# Altium schematic sheet Sheet7.SchDoc
size A3
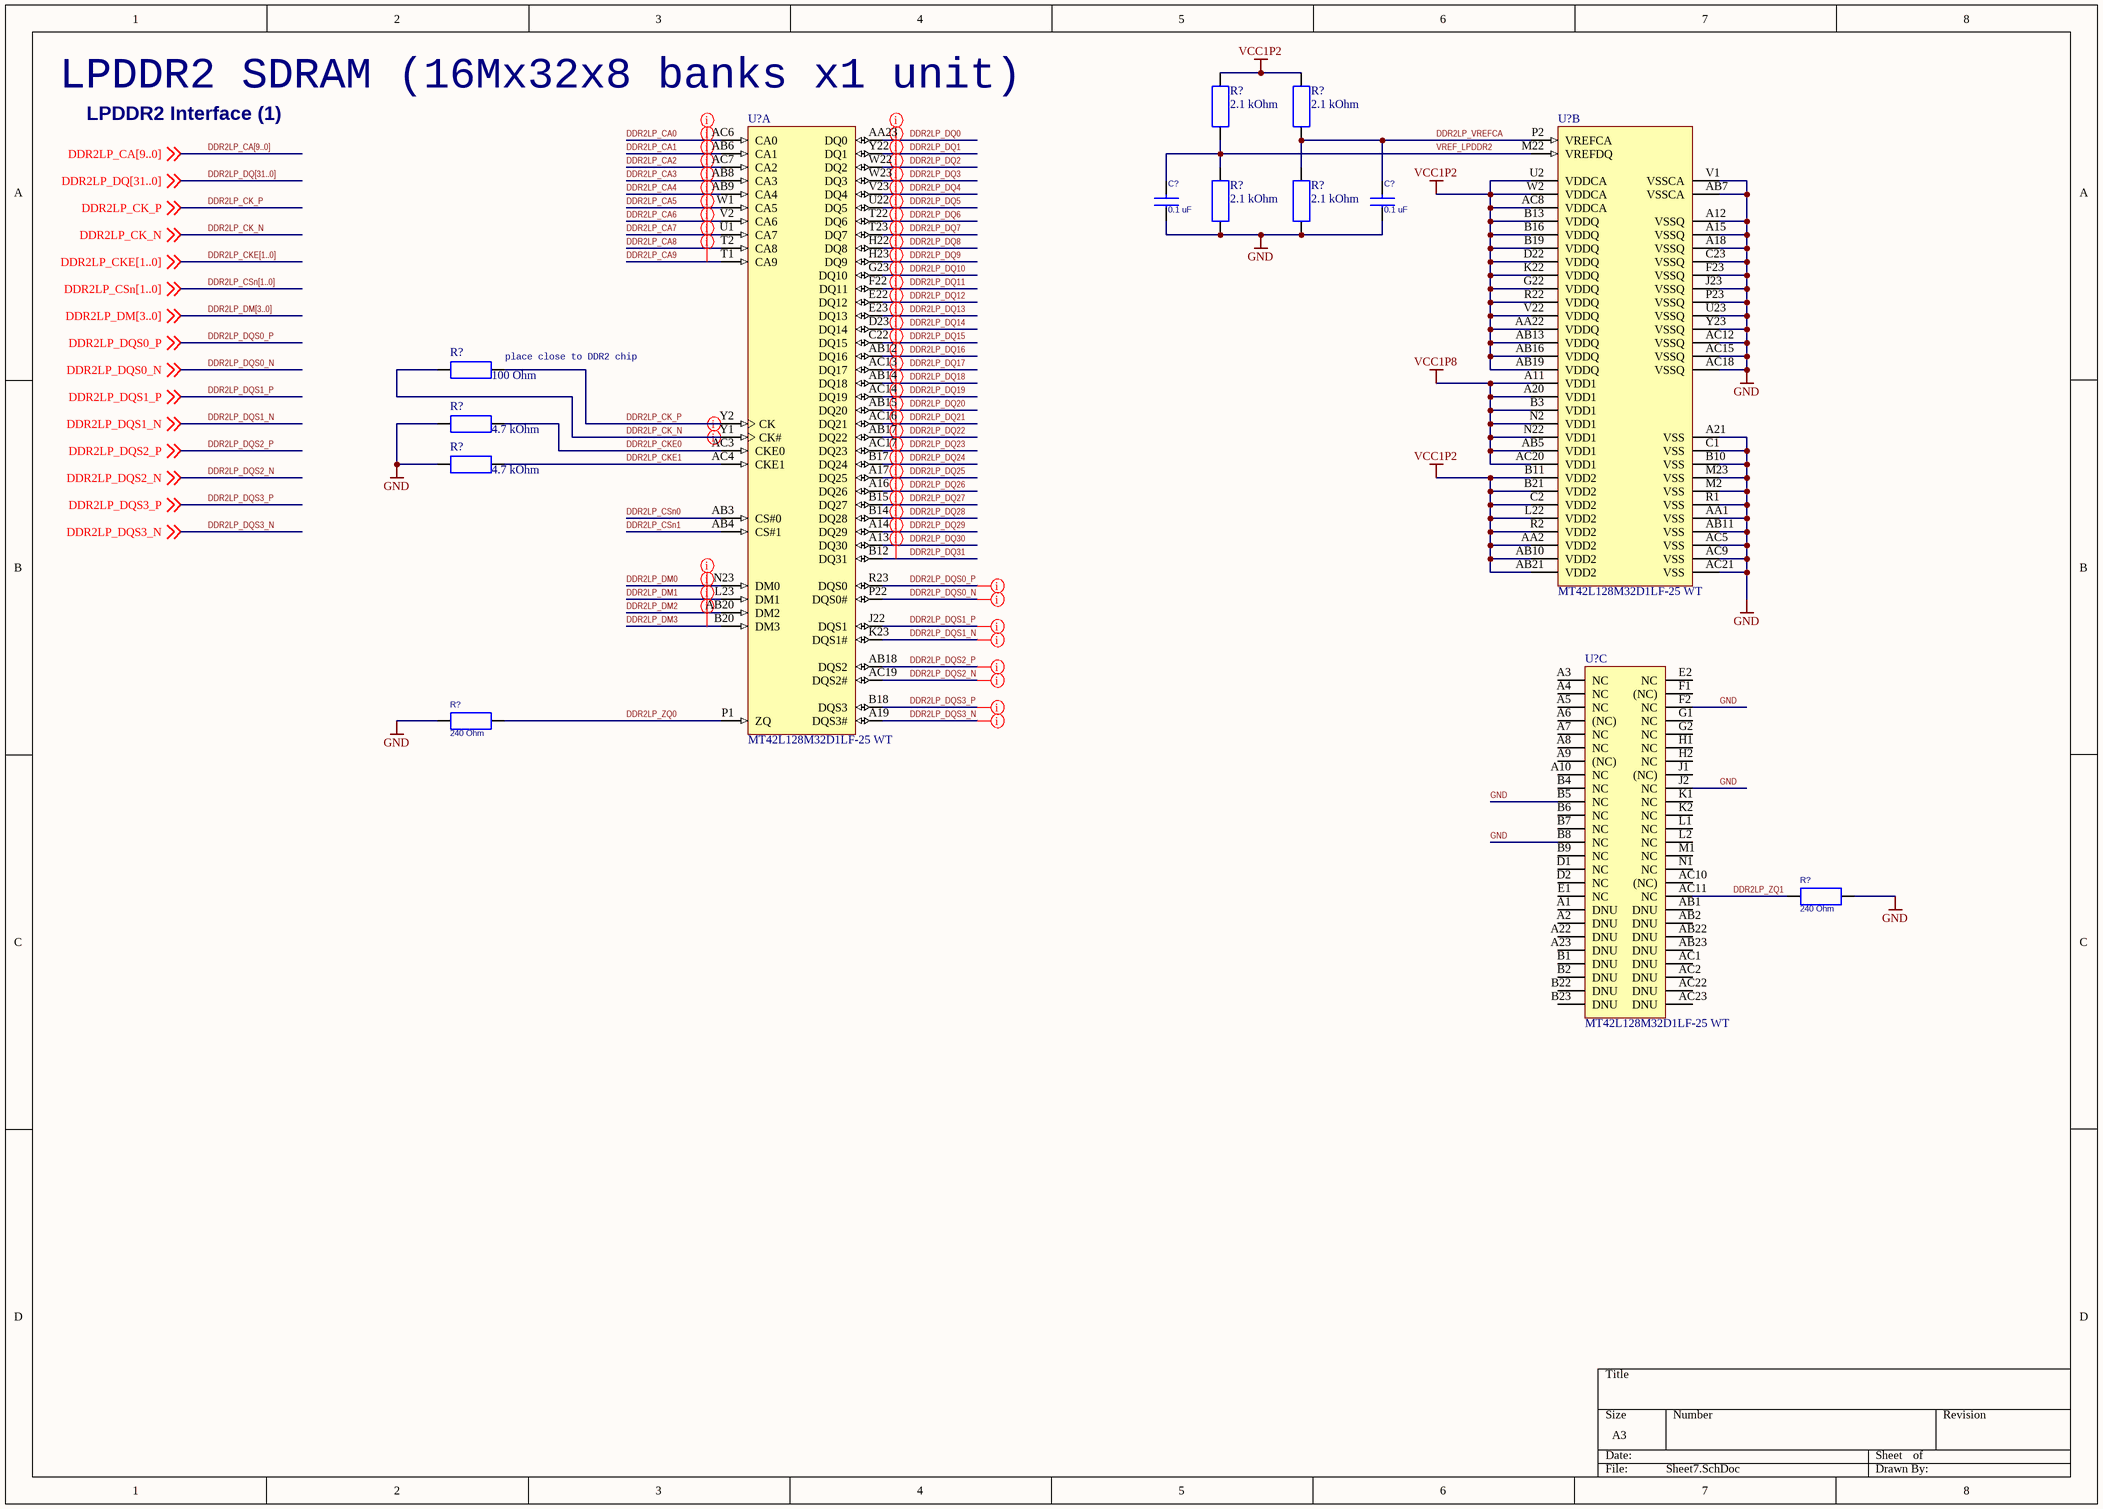
[diagram p0: Sheet7.SchDoc]

## Parts
(Parts that share a designator on the sheet are numbered #1, #2 ... from top to bottom, then left to right.)
C?#1  0.1 uF  [CAPC1608N]
C?#2  0.1 uF  [CAPC1608N]
R?#1  2.1 kOhm  [RESC1608N]
R?#2  2.1 kOhm  [RESC1608N]
R?#3  2.1 kOhm  [RESC1608N]
R?#4  2.1 kOhm  [RESC1608N]
R?#5  100 Ohm  [RESC1608N]
R?#6  4.7 kOhm  [RESC1608N]
R?#7  4.7 kOhm  [RESC1608N]
R?#8  240 Ohm  [RESC1608N]
R?#9  240 Ohm  [RESC1608N]
U?#1  MT42L128M32D1LF-25 WT  [MICT-LF-168]  (part A of 3)
U?#2  MT42L128M32D1LF-25 WT  [MICT-LF-168]  (part B of 3)
U?#3  MT42L128M32D1LF-25 WT  [MICT-LF-168]  (part C of 3)

## Nets
GND: C?#1.1 C?#2.1 R?#3.1 R?#4.1 R?#6.2 R?#7.2 R?#8.1 R?#9.2 U?#2.A12(VSSQ) U?#2.A15(VSSQ) U?#2.A18(VSSQ) U?#2.A21(VSS) U?#2.AA1(VSS) U?#2.AB7(VSSCA) U?#2.AB11(VSS) U?#2.AC5(VSS) U?#2.AC9(VSS) U?#2.AC12(VSSQ) U?#2.AC15(VSSQ) U?#2.AC18(VSSQ) U?#2.AC21(VSS) U?#2.B10(VSS) U?#2.C1(VSS) U?#2.C23(VSSQ) U?#2.F23(VSSQ) U?#2.J23(VSSQ) U?#2.M2(VSS) U?#2.M23(VSS) U?#2.P23(VSSQ) U?#2.R1(VSS) U?#2.U23(VSSQ) U?#2.V1(VSSCA) U?#2.Y23(VSSQ) U?#3.B5(NC) U?#3.B8(NC) U?#3.F2(NC) U?#3.J2(NC)
VCC1P2: R?#1.2 R?#2.2 U?#2.AA2(VDD2) U?#2.AA22(VDDQ) U?#2.AB10(VDD2) U?#2.AB13(VDDQ) U?#2.AB16(VDDQ) U?#2.AB19(VDDQ) U?#2.AB21(VDD2) U?#2.AC8(VDDCA) U?#2.B11(VDD2) U?#2.B13(VDDQ) U?#2.B16(VDDQ) U?#2.B19(VDDQ) U?#2.B21(VDD2) U?#2.C2(VDD2) U?#2.D22(VDDQ) U?#2.G22(VDDQ) U?#2.K22(VDDQ) U?#2.L22(VDD2) U?#2.R2(VDD2) U?#2.R22(VDDQ) U?#2.U2(VDDCA) U?#2.V22(VDDQ) U?#2.W2(VDDCA)
VCC1P8: U?#2.A11(VDD1) U?#2.A20(VDD1) U?#2.AB5(VDD1) U?#2.AC20(VDD1) U?#2.B3(VDD1) U?#2.N2(VDD1) U?#2.N22(VDD1)
DDR2LP_CA0: U?#1.AC6(CA0)
DDR2LP_CA1: U?#1.AB6(CA1)
DDR2LP_CA2: U?#1.AC7(CA2)
DDR2LP_CA3: U?#1.AB8(CA3)
DDR2LP_CA4: U?#1.AB9(CA4)
DDR2LP_CA5: U?#1.W1(CA5)
DDR2LP_CA6: U?#1.V2(CA6)
DDR2LP_CA7: U?#1.U1(CA7)
DDR2LP_CA8: U?#1.T2(CA8)
DDR2LP_CA9: U?#1.T1(CA9)
DDR2LP_CK_N: R?#5.2 U?#1.Y1(CK#) ; off-sheet DDR2LP_CK_N
DDR2LP_CK_P: R?#5.1 U?#1.Y2(CK) ; off-sheet DDR2LP_CK_P
DDR2LP_CKE0: R?#6.1 U?#1.AC3(CKE0)
DDR2LP_CKE1: R?#7.1 U?#1.AC4(CKE1)
DDR2LP_CSn0: U?#1.AB3(CS#0)
DDR2LP_CSn1: U?#1.AB4(CS#1)
DDR2LP_DM0: U?#1.N23(DM0)
DDR2LP_DM1: U?#1.L23(DM1)
DDR2LP_DM2: U?#1.AB20(DM2)
DDR2LP_DM3: U?#1.B20(DM3)
DDR2LP_DQ0: U?#1.AA23(DQ0)
DDR2LP_DQ1: U?#1.Y22(DQ1)
DDR2LP_DQ2: U?#1.W22(DQ2)
DDR2LP_DQ3: U?#1.W23(DQ3)
DDR2LP_DQ4: U?#1.V23(DQ4)
DDR2LP_DQ5: U?#1.U22(DQ5)
DDR2LP_DQ6: U?#1.T22(DQ6)
DDR2LP_DQ7: U?#1.T23(DQ7)
DDR2LP_DQ8: U?#1.H22(DQ8)
DDR2LP_DQ9: U?#1.H23(DQ9)
DDR2LP_DQ10: U?#1.G23(DQ10)
DDR2LP_DQ11: U?#1.F22(DQ11)
DDR2LP_DQ12: U?#1.E22(DQ12)
DDR2LP_DQ13: U?#1.E23(DQ13)
DDR2LP_DQ14: U?#1.D23(DQ14)
DDR2LP_DQ15: U?#1.C22(DQ15)
DDR2LP_DQ16: U?#1.AB12(DQ16)
DDR2LP_DQ17: U?#1.AC13(DQ17)
DDR2LP_DQ18: U?#1.AB14(DQ18)
DDR2LP_DQ19: U?#1.AC14(DQ19)
DDR2LP_DQ20: U?#1.AB15(DQ20)
DDR2LP_DQ21: U?#1.AC16(DQ21)
DDR2LP_DQ22: U?#1.AB17(DQ22)
DDR2LP_DQ23: U?#1.AC17(DQ23)
DDR2LP_DQ24: U?#1.B17(DQ24)
DDR2LP_DQ25: U?#1.A17(DQ25)
DDR2LP_DQ26: U?#1.A16(DQ26)
DDR2LP_DQ27: U?#1.B15(DQ27)
DDR2LP_DQ28: U?#1.B14(DQ28)
DDR2LP_DQ29: U?#1.A14(DQ29)
DDR2LP_DQ30: U?#1.A13(DQ30)
DDR2LP_DQ31: U?#1.B12(DQ31)
DDR2LP_DQS0_N: U?#1.P22(DQS0#) ; off-sheet DDR2LP_DQS0_N
DDR2LP_DQS0_P: U?#1.R23(DQS0) ; off-sheet DDR2LP_DQS0_P
DDR2LP_DQS1_N: U?#1.K23(DQS1#) ; off-sheet DDR2LP_DQS1_N
DDR2LP_DQS1_P: U?#1.J22(DQS1) ; off-sheet DDR2LP_DQS1_P
DDR2LP_DQS2_N: U?#1.AC19(DQS2#) ; off-sheet DDR2LP_DQS2_N
DDR2LP_DQS2_P: U?#1.AB18(DQS2) ; off-sheet DDR2LP_DQS2_P
DDR2LP_DQS3_N: U?#1.A19(DQS3#) ; off-sheet DDR2LP_DQS3_N
DDR2LP_DQS3_P: U?#1.B18(DQS3) ; off-sheet DDR2LP_DQS3_P
DDR2LP_VREFCA: C?#2.2 R?#2.1 R?#4.2 U?#2.P2(VREFCA)
DDR2LP_ZQ0: R?#8.2 U?#1.P1(ZQ)
DDR2LP_ZQ1: R?#9.1 U?#3.AC11(NC)
VREF_LPDDR2: C?#1.2 R?#1.1 R?#3.2 U?#2.M22(VREFDQ)

Not connected (* = marked no-connect by the designer): U?#3 A1(DNU) A2(DNU) A3(NC) A4(NC) A5(NC) A6((NC)) A7(NC) A8(NC) A9((NC)) A10(NC) A22(DNU) A23(DNU) AB1(DNU) AB2(DNU) AB22(DNU) AB23(DNU) AC1(DNU) AC2(DNU) AC10((NC)) AC22(DNU) AC23(DNU) B1(DNU) B2(DNU) B4(NC) B6(NC) B7(NC) B9(NC) B22(DNU) B23(DNU) D1(NC) D2(NC) E1(NC) E2(NC) F1((NC)) G1(NC) G2(NC) H1(NC) H2(NC) J1((NC)) K1(NC) K2(NC) L1(NC) L2(NC) M1(NC) N1(NC)

## Buses and harness runs
bus DDR2LP_CA[9..0]
bus DDR2LP_CKE[1..0]
bus DDR2LP_CSn[1..0]
bus DDR2LP_DM[3..0]
bus DDR2LP_DQ[31..0]

## Layout directives
net class DDR2LP_DQ: DDR2LP_DQ0, DDR2LP_DQ1, DDR2LP_DQ2, DDR2LP_DQ3, DDR2LP_DQ4, DDR2LP_DQ5, DDR2LP_DQ6, DDR2LP_DQ7, DDR2LP_DQ8, DDR2LP_DQ9, DDR2LP_DQ10, DDR2LP_DQ11, DDR2LP_DQ12, DDR2LP_DQ13, DDR2LP_DQ14, DDR2LP_DQ15, DDR2LP_DQ16, DDR2LP_DQ17, DDR2LP_DQ18, DDR2LP_DQ19, DDR2LP_DQ20, DDR2LP_DQ21, DDR2LP_DQ22, DDR2LP_DQ23, DDR2LP_DQ24, DDR2LP_DQ25, DDR2LP_DQ26, DDR2LP_DQ27, DDR2LP_DQ28, DDR2LP_DQ29, DDR2LP_DQ30, DDR2LP_DQ31
net class DDR2LP_CA: DDR2LP_CA0, DDR2LP_CA1, DDR2LP_CA2, DDR2LP_CA3, DDR2LP_CA4, DDR2LP_CA5, DDR2LP_CA6, DDR2LP_CA7, DDR2LP_CA8, DDR2LP_CA9
net class DDR2LP_DM: DDR2LP_DM0, DDR2LP_DM1, DDR2LP_DM2, DDR2LP_DM3
differential pair: DDR2LP_CK_N, DDR2LP_CK_P, DDR2LP_DQS0_N, DDR2LP_DQS0_P, DDR2LP_DQS1_N, DDR2LP_DQS1_P, DDR2LP_DQS2_N, DDR2LP_DQS2_P, DDR2LP_DQS3_N, DDR2LP_DQS3_P

## Notes on the sheet
- (near U?#1) LPDDR2 SDRAM (16Mx32x8 banks x1 unit)
- LPDDR2 Interface (1)
- (near R?#5) place close to DDR2 chip

## Library data of the parts
C?#1 C?#2 = CC0603: Vendor: DigiKey; Oper. Temp. Range: -55C to 85C; RoHS: Yes; Package: 0603
R?#1-R?#9 = RC0603: Oper. Temp. Range: -55C to 125C; RoHS: Yes; Package: 0603
U?#1-U?#3 = MT42L128M32D1LF-25 WT: 4Gb LPDDR2-800 SDRAM, 128Mb x 32, 2.5ns, 1.2V, -25 to 85 degC, 168-Ball WFBGA, Pb-Free; Manufacturer: Micron; Clock Rate: 400 MHz; Op. Temp.: -25C to +85C; DatasheetVersion: Rev.L; PackageVersion: Rev.L; PackageReference: MICT-LF-168; PackageDescription: 168-Ball Fine-Pitch Ball Grid Array, 12 x 12 mm, Pitch 0.5 mm; Cycle Time: 2.5ns; Data Rate: LPDDR2-800; Density: 4Gb; Depth: 128Mb; Package: WFBGA; Part Status: Sampling; Pin Count: 168-ball; RoHS: Yes; Technology: Mobile LPDDR2; Voltage: 1.2V; Width: x32; Mounting Technology: Surface Mount; PartNumber: MT42L128M32D1LF-25 WT; ComponentLink1Description: Manufacturer URL; ComponentLink1URL: http://www.micron.com/; ComponentLink2Description: Datasheet; ComponentLink2URL: http://www.micron.com/~/media/Documents/Products/Data%20Sheet/DRAM/Mobile%20DRAM/Low-Power%20DRAM/LPDDR2/U80M_4Gb_mobile_lpddr2_s4_sdram.pdf; ComponentLink3Description: Package Specification; ComponentLink3URL: http://www.micron.com/~/media/Documents/Products/Data%20Sheet/DRAM/Mobile%20DRAM/Low-Power%20DRAM/LPDDR2/U80M_4Gb_mobile_lpddr2_s4_sdram.pdf